# EAGLE design MainBoard (EAGLE 9.5.1)

## Sheet 1 of 2
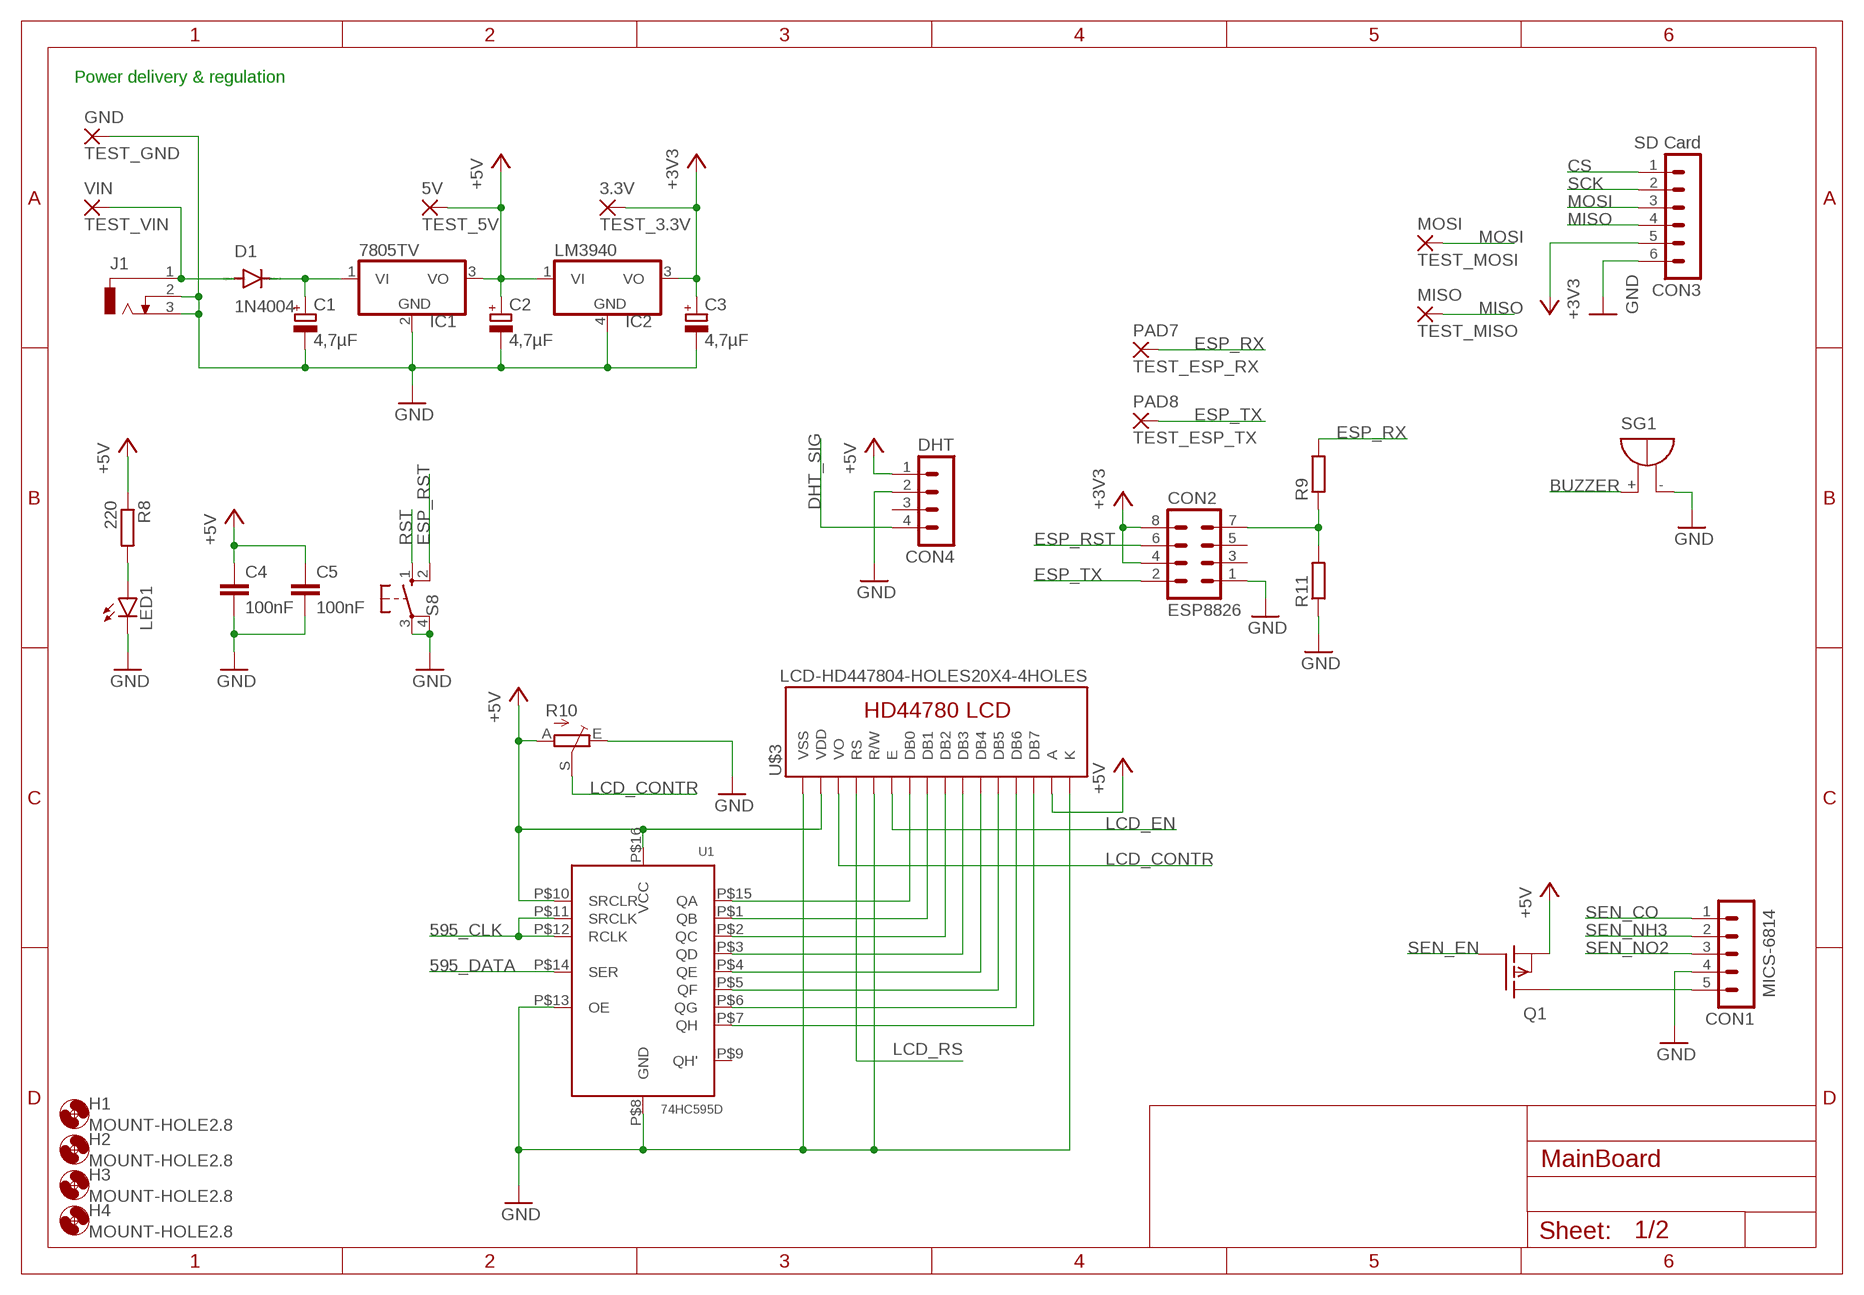
[diagram p0: schematic, sheet 1]

### Parts
3.3V  TEST_3.3V  WIREPAD2,54/0,9  [2,54/0,9]
5V  TEST_5V  WIREPAD2,54/0,9  [2,54/0,9]
C1  4,7µF  CPOL-EUE2,5-6E  [E2,5-6E]
C2  4,7µF  CPOL-EUE2,5-6E  [E2,5-6E]
C3  4,7µF  CPOL-EUE2,5-6E  [E2,5-6E]
C4  100nF  C-EUC0805  [C0805]
C5  100nF  C-EUC0805  [C0805]
CON1  MICS-6814  MA05-1  [MA05-1]
CON2  ESP8826  MA04-2  [MA04-2]
CON3  SD Card  MA06-1  [MA06-1]
CON4  DHT  MA04-1  [MA04-1]
D1  1N4004  BAS15  [DO34-7]
GND  TEST_GND  WIREPAD2,54/0,9  [2,54/0,9]
H1  MOUNT-HOLE2.8  [2,8]
H2  MOUNT-HOLE2.8  [2,8]
H3  MOUNT-HOLE2.8  [2,8]
H4  MOUNT-HOLE2.8  [2,8]
IC1  7805TV  [TO220V]
IC2  LM3940  LM340MP-05  [SOT223]
J1  DCJ0303  [DCJ0303]
LED1  LED3MM  [LED3MM]
MISO  TEST_MISO  WIREPAD2,54/0,9  [2,54/0,9]
MOSI  TEST_MOSI  WIREPAD2,54/0,9  [2,54/0,9]
PAD7  TEST_ESP_RX  WIREPAD2,54/0,9  [2,54/0,9]
PAD8  TEST_ESP_TX  WIREPAD2,54/0,9  [2,54/0,9]
Q1  LP0701N3  [TO-92]
R8  220  R-EU_0204/7  [0204/7]
R9  R-EU_M0805  [M0805]
R10  TRIM_EU-RJ9W  [RJ9W]
R11  R-EU_M0805  [M0805]
S8  10-XX  [B3F-10XX]
SG1  F/TMB  [F/TMB]
U1  74HC595D  74HC595D_SOP16  [SOP-16]
U$3  LCD-HD447804-HOLES20X4-4HOLES  [LCD-20X4-4HOLES]
VIN  TEST_VIN  WIREPAD2,54/0,9  [2,54/0,9]

### Nets
595_CLK: U1.P$11(SRCLK) U1.P$12(RCLK) ; also sheet 2
595_DATA: U1.P$14(SER) ; also sheet 2
+3V3: 3.3V.1(P) C3.+ CON2.4 CON2.8 CON3.5 IC2.3(VO)
+5V: 5V.1(P) C2.+ C4.1 C5.1 CON4.1 IC1.3(VO) IC2.1(VI) Q1.1(S) R8.1 R10.A U1.P$10(SRCLR) U1.P$16(VCC) U$3.P$2(VDD) U$3.P$15(A) ; also sheet 2
BUZZER: SG1.+ ; also sheet 2
CS: CON3.1 ; also sheet 2
DHT_SIG: CON4.4 ; also sheet 2
ESP_RST: CON2.6 S8.2(S1)
ESP_RX: PAD7.1(P) R9.2 ; also sheet 2
ESP_TX: CON2.2 PAD8.1(P) ; also sheet 2
GND: C1.- C2.- C3.- C4.2 C5.2 CON1.4 CON2.1 CON3.6 CON4.2 GND.1(P) IC1.2(GND) IC2.4(GND) J1.2 J1.3 LED1.K(C) R10.E R11.1 S8.3(P) S8.4(P1) SG1.- U1.P$8(GND) U1.P$13(OE) U$3.P$1(VSS) U$3.P$5(R/W) U$3.P$16(K) ; also sheet 2
LCD_CONTR: R10.S U$3.P$3(VO)
LCD_EN: U$3.P$6(E) ; also sheet 2
LCD_RS: U$3.P$4(RS) ; also sheet 2
MISO: CON3.4 MISO.1(P) ; also sheet 2
MOSI: CON3.3 MOSI.1(P) ; also sheet 2
N$1: LED1.A R8.2
N$2: CON2.7 R9.1 R11.2
N$3: U1.P$15(QA) U$3.P$7(DB0)
N$4: U1.P$1(QB) U$3.P$8(DB1)
N$5: U1.P$2(QC) U$3.P$9(DB2)
N$6: U1.P$3(QD) U$3.P$10(DB3)
N$7: U1.P$4(QE) U$3.P$11(DB4)
N$8: U1.P$5(QF) U$3.P$12(DB5)
N$9: U1.P$6(QG) U$3.P$13(DB6)
N$10: U1.P$7(QH) U$3.P$14(DB7)
N$20: D1.A J1.1 VIN.1(P)
N$21: C1.+ D1.C IC1.1(VI)
N$26: CON1.5 Q1.3(D)
RST: S8.1(S) ; also sheet 2
SCK: CON3.2 ; also sheet 2
SEN_CO: CON1.1 ; also sheet 2
SEN_EN: Q1.2(G) ; also sheet 2
SEN_NH3: CON1.2 ; also sheet 2
SEN_NO2: CON1.3 ; also sheet 2
Unconnected: CON2.3 CON2.5 CON4.3 U1.P$9(QH')

### Notes on the sheet
- Power delivery & regulation

## Sheet 2 of 2
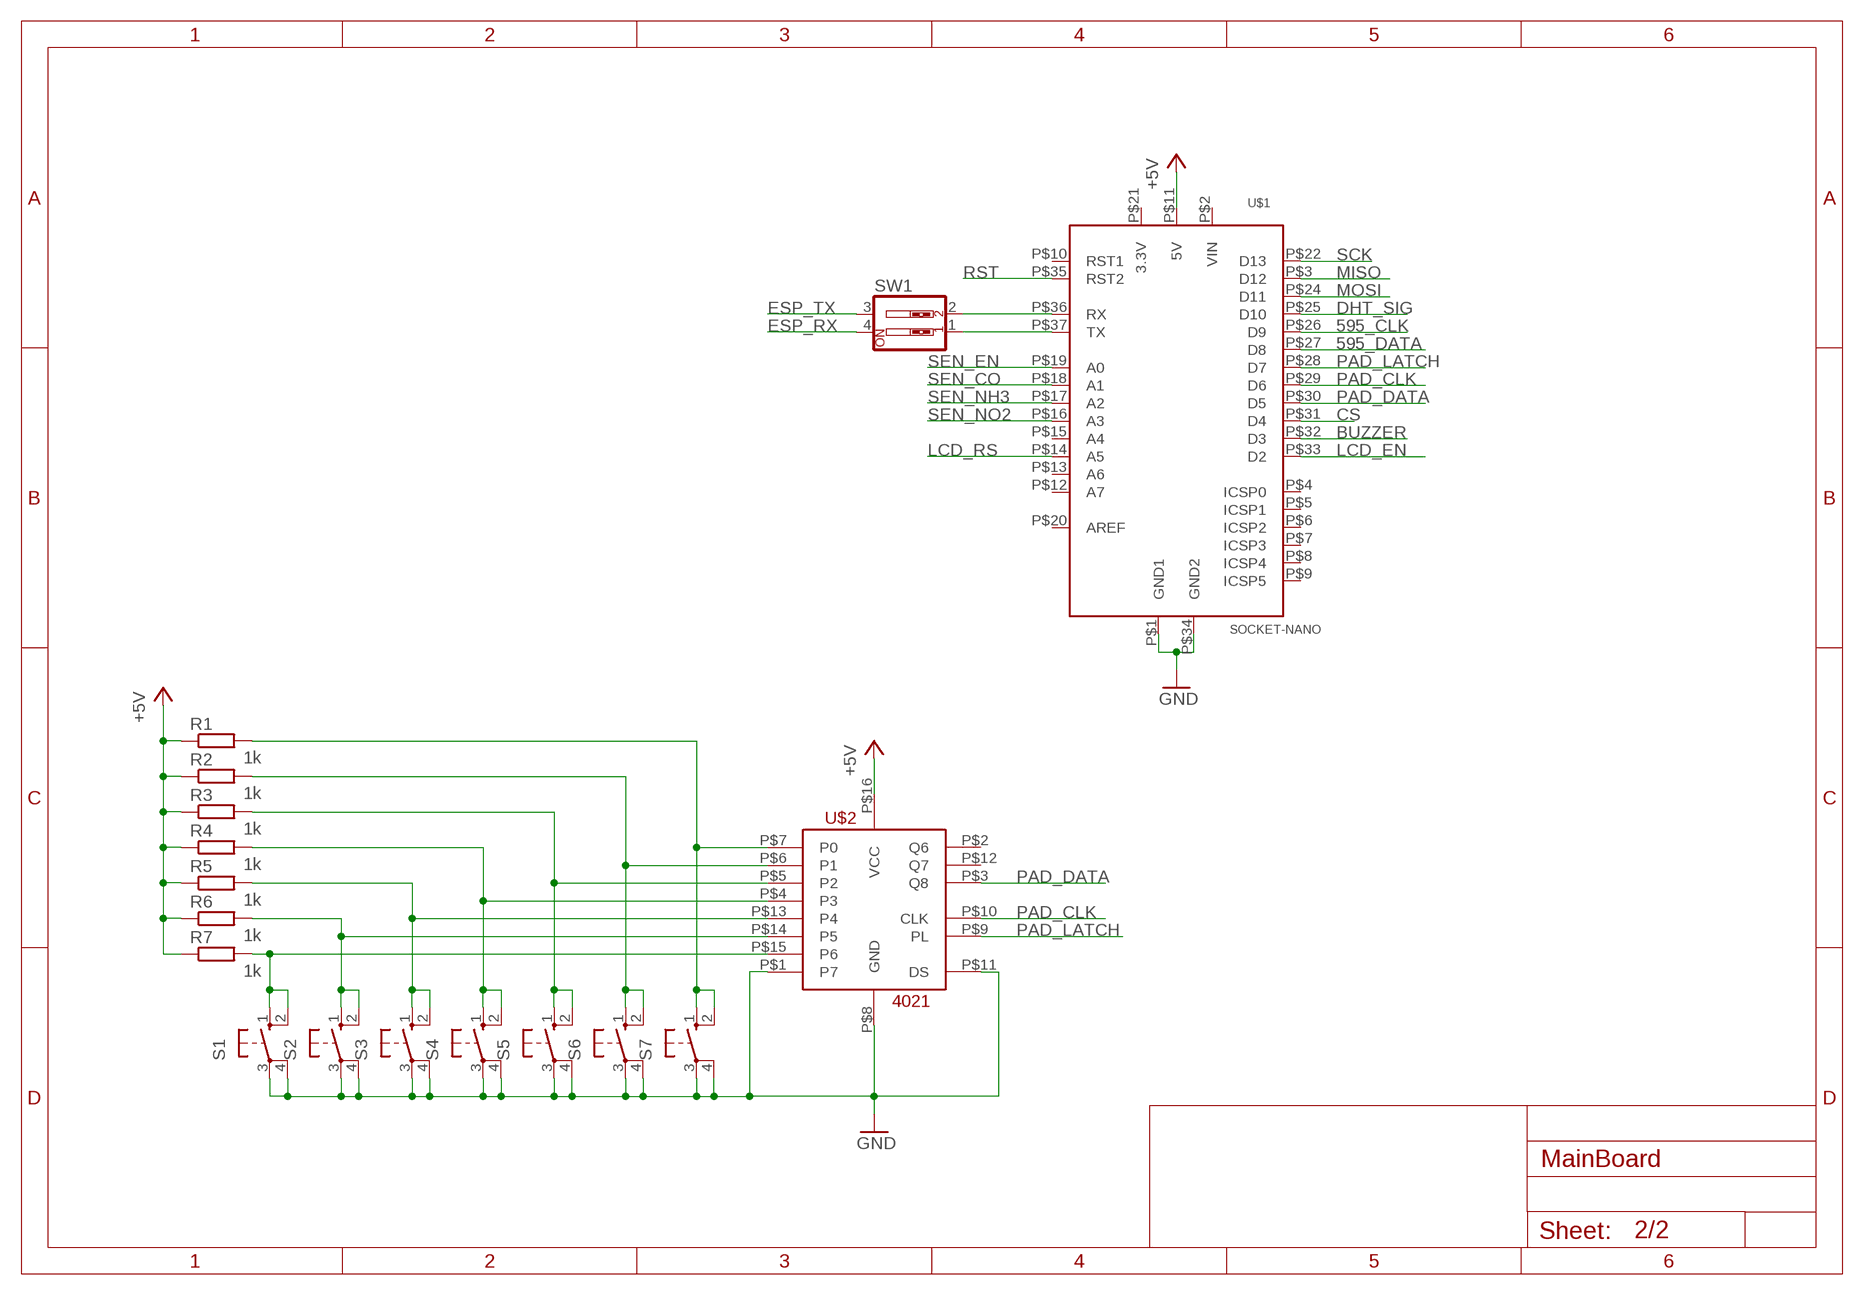
[diagram p1: schematic, sheet 2]

### Parts
R1  1k  R-EU_0204/7  [0204/7]
R2  1k  R-EU_0204/7  [0204/7]
R3  1k  R-EU_0204/7  [0204/7]
R4  1k  R-EU_0204/7  [0204/7]
R5  1k  R-EU_0204/7  [0204/7]
R6  1k  R-EU_0204/7  [0204/7]
R7  1k  R-EU_0204/7  [0204/7]
S1  10-XX  [B3F-10XX]
S2  10-XX  [B3F-10XX]
S3  10-XX  [B3F-10XX]
S4  10-XX  [B3F-10XX]
S5  10-XX  [B3F-10XX]
S6  10-XX  [B3F-10XX]
S7  10-XX  [B3F-10XX]
SW1  SW_DIP-2  [EDG-02]
U$1  SOCKET-NANO  [SOCKET-NANO]
U$2  4021  [DIP]

### Nets
595_CLK: U$1.P$26(D9) ; also sheet 1
595_DATA: U$1.P$27(D8) ; also sheet 1
+5V: R1.1 R2.1 R3.1 R4.1 R5.1 R6.1 R7.1 U$1.P$11(5V) U$2.P$16(VCC) ; also sheet 1
BUZZER: U$1.P$32(D3) ; also sheet 1
CS: U$1.P$31(D4) ; also sheet 1
DHT_SIG: U$1.P$25(D10) ; also sheet 1
ESP_RX: SW1.4 ; also sheet 1
ESP_TX: SW1.3 ; also sheet 1
GND: S1.3(P) S1.4(P1) S2.3(P) S2.4(P1) S3.3(P) S3.4(P1) S4.3(P) S4.4(P1) S5.3(P) S5.4(P1) S6.3(P) S6.4(P1) S7.3(P) S7.4(P1) U$1.P$1(GND1) U$1.P$34(GND2) U$2.P$1(P7) U$2.P$8(GND) U$2.P$11(DS) ; also sheet 1
LCD_EN: U$1.P$33(D2) ; also sheet 1
LCD_RS: U$1.P$14(A5) ; also sheet 1
MISO: U$1.P$3(D12) ; also sheet 1
MOSI: U$1.P$24(D11) ; also sheet 1
N$11: R7.2 S1.1(S) S1.2(S1) U$2.P$15(P6)
N$13: R6.2 S2.1(S) S2.2(S1) U$2.P$14(P5)
N$14: R5.2 S3.1(S) S3.2(S1) U$2.P$13(P4)
N$15: R4.2 S4.1(S) S4.2(S1) U$2.P$4(P3)
N$16: R3.2 S5.1(S) S5.2(S1) U$2.P$5(P2)
N$17: R2.2 S6.1(S) S6.2(S1) U$2.P$6(P1)
N$18: R1.2 S7.1(S) S7.2(S1) U$2.P$7(P0)
N$22: SW1.2 U$1.P$36(RX)
N$23: SW1.1 U$1.P$37(TX)
PAD_CLK: U$1.P$29(D6) U$2.P$10(CLK)
PAD_DATA: U$1.P$30(D5) U$2.P$3(Q8)
PAD_LATCH: U$1.P$28(D7) U$2.P$9(PL)
RST: U$1.P$35(RST2) ; also sheet 1
SCK: U$1.P$22(D13) ; also sheet 1
SEN_CO: U$1.P$18(A1) ; also sheet 1
SEN_EN: U$1.P$19(A0) ; also sheet 1
SEN_NH3: U$1.P$17(A2) ; also sheet 1
SEN_NO2: U$1.P$16(A3) ; also sheet 1
Unconnected: U$1.P$4(ICSP0) U$1.P$5(ICSP1) U$1.P$6(ICSP2) U$1.P$7(ICSP3) U$1.P$8(ICSP4) U$1.P$9(ICSP5) U$1.P$10(RST1) U$1.P$12(A7) U$1.P$13(A6) U$1.P$15(A4) U$1.P$20(AREF) U$2.P$2(Q6) U$2.P$12(Q7)

## Power pins joined to a net without a drawn wire
3.3V: U$1.P$21(3.3V)
VIN: U$1.P$2(VIN)

## Library data of the parts
3.3V 5V GND MISO MOSI PAD7 PAD8 VIN = wirepad:WIREPAD: Wire PAD connect wire on PCB
C1-C3 = rcl:CPOL-EU: POLARIZED CAPACITOR, European symbol; SPICEPREFIX: C
C4 C5 = rcl:C-EU: CAPACITOR, European symbol; SPICEPREFIX: C
CON1 = con-lstb:MA05-1: PIN HEADER; OC_FARNELL: unknown; OC_NEWARK: unknown
CON2 = con-lstb:MA04-2: PIN HEADER; OC_FARNELL: unknown; OC_NEWARK: unknown
CON3 = con-lstb:MA06-1: PIN HEADER; OC_FARNELL: unknown; OC_NEWARK: unknown
CON4 = con-lstb:MA04-1: PIN HEADER; OC_FARNELL: unknown; OC_NEWARK: unknown
D1 = diode:BAS15: DIODE high speed
H1-H4 = holes:MOUNT-HOLE: MOUNTING HOLE with drill center marker
IC1 = linear:78*: Positive VOLTAGE REGULATOR Source: http://cache.national.com/ds/LM/LM78L05.pdf http://www.fairchildsemi.com/ds/LM/LM7805.pdf
IC2 = linear:LM340?-*: Positive VOLTAGE REGULATOR Source: http://cache.national.com/ds/LM/LM340.pdf
J1 = con-jack:DCJ0303: DC POWER JACK Source: DCJ0303.pdf; OC_FARNELL: unknown; OC_NEWARK: unknown
LED1 = led:LED: LED OSRAM: - CHIPLED LG R971, LG N971, LY N971, LG Q971, LY Q971, LO R971, LY R971 LH N974, LH R974 LS Q976, LO Q976, LY Q976 LO Q996 - Hyper CHIPLED LW Q18S LB Q993, LB Q99A, LB R99A - SideLED LS A670, LO A670, LY A670, LG A670, LP A670 LB A673, LV A673, LT A673, LW A673 LH A674 LY A675 LS A676, LA A676, LO A676, LY A676, LW A676 LS A679, LY A679, LG A679 - Hyper Micro SIDELED® LS Y876, LA Y876, LO Y876, LY Y876 LT Y87S - SmartLED LW L88C, LW L88S LB L89C, LB L89S, LG L890 LS L89K, LO L89K, LY L89K LS L896, LA L896, LO L896, LY L896 - TOPLED LS T670, LO T670, LY T670, LG T670, LP T670 LSG T670, LSP T670, LSY T670, LOP T670, LYG T670 LG T671, LOG T671, LSG T671 LB T673, LV T673, LT T673, LW T673 LH T674 LS T676, LA T676, LO T676, LY T676, LB T676, LH T676, LSB T676, LW T676 LB T67C, LV T67C, LT T67C, LS T67K, LO T67K, LY T67K, LW E67C LS E67B, LA E67B, LO E67B, LY E67B, LB E67C, LV E67C, LT E67C LW T67C LS T679, LY T679, LG T679 LS T770, LO T770, LY T770, LG T770, LP T770 LB T773, LV T773, LT T773, LW T773 LH T774 LS E675, LA E675, LY E675, LS T675 LS T776, LA T776, LO T776, LY T776, LB T776 LHGB T686 LT T68C, LB T68C - Hyper Mini TOPLED® LB M676 - Mini TOPLED Santana® LG M470 LS M47K, LO M47K, LY M47K Source: http://www.osram.convergy.de LUXEON: - LUMILED® LXK2-PW12-R00, LXK2-PW12-S00, LXK2-PW14-U00, LXK2-PW14-V00 LXK2-PM12-R00, LXK2-PM12-S00, LXK2-PM14-U00 LXK2-PE12-Q00, LXK2-PE12-R00, LXK2-PE12-S00, LXK2-PE14-T00, LXK2-PE14-U00 LXK2-PB12-K00, LXK2-PB12-L00, LXK2-PB12-M00, LXK2-PB14-N00, LXK2-PB14-P00, LXK2-PB14-Q00 LXK2-PR12-L00, LXK2-PR12-M00, LXK2-PR14-Q00, LXK2-PR14-R00 LXK2-PD12-Q00, LXK2-PD12-R00, LXK2-PD12-S00 LXK2-PH12-R00, LXK2-PH12-S00 LXK2-PL12-P00, LXK2-PL12-Q00, LXK2-PL12-R00 Source: www.luxeon.com KINGBRIGHT: KA-3528ASYC Source: www.kingbright.com
Q1 = transistor-fet:LP0701N3: P-Channel Enhancement MOSFET -16,5V; -1,25A; 1,5Ohm
R1-R9 R11 = rcl:R-EU_: RESISTOR, European symbol; SPICEPREFIX: R
R10 = pot:TRIM_EU-: POTENTIOMETER
S1-S8 = switch-omron:10-XX: OMRON SWITCH; MPN: B3F-1000; OC_FARNELL: 176432; OC_NEWARK: 36M3542
SG1 = buzzer:F/TMB: BUZZER Source: Buerklin; OC_FARNELL: unknown; OC_NEWARK: unknown
SW1 = special:SW_DIP-2: DIP SWITCH
U1 = 74-series-ajouts:74HC595D_SOP16
U$1 = ArduinoSockets:SOCKET-NANO
U$2 = 4021:4021
U$3 = HD44780LCD:LCD-HD44780

## Board
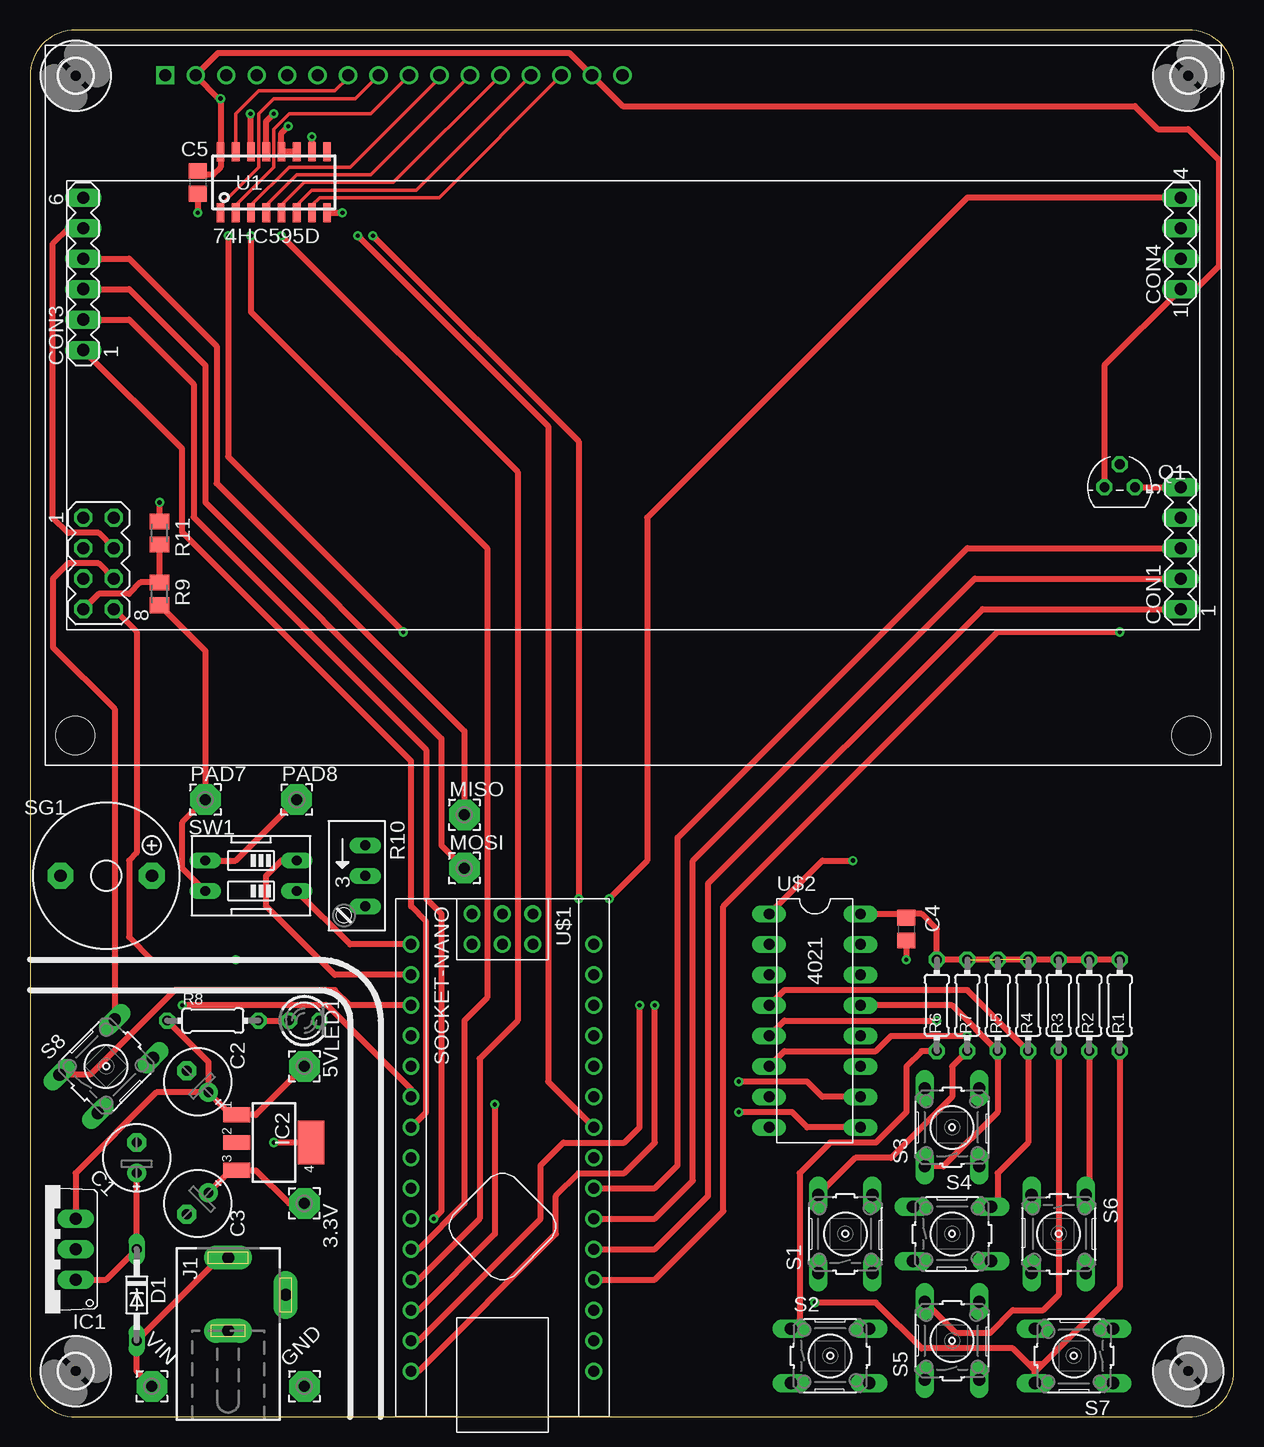
[diagram p2: board, top side]
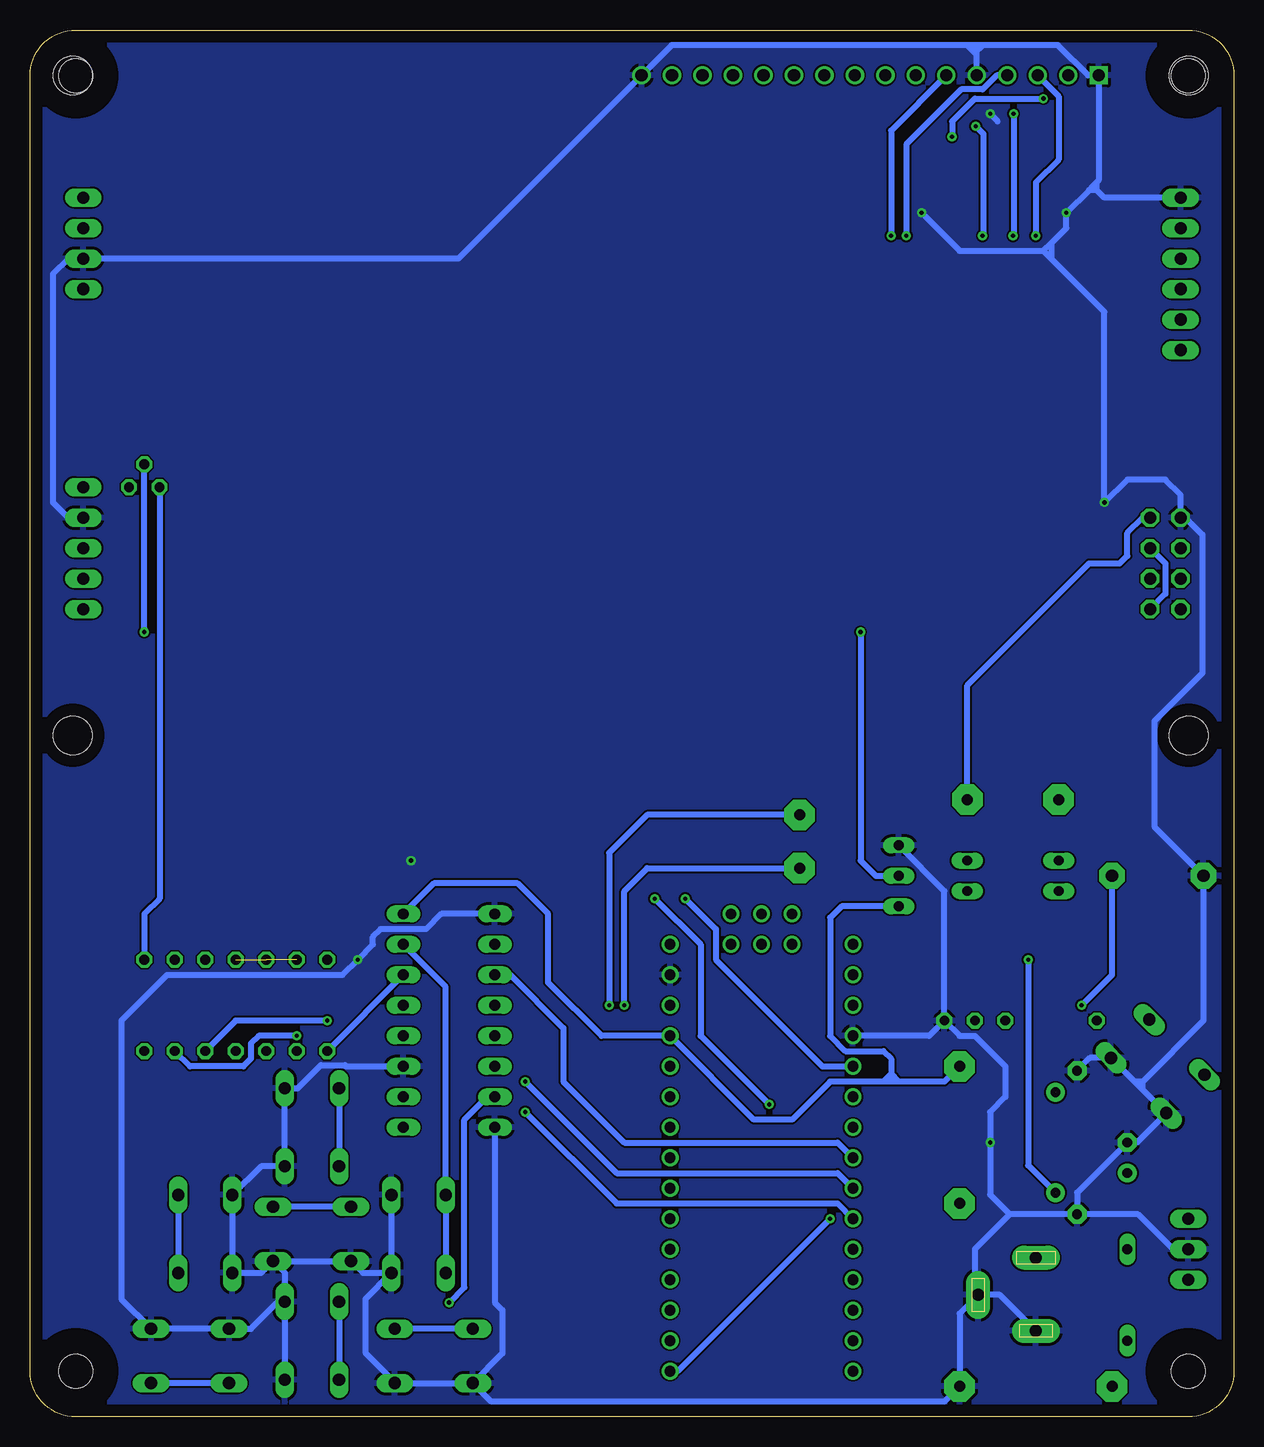
[diagram p3: board, bottom side, seen from below]

Size 100.33 x 115.57 mm. Coordinates in mm from the lower left corner, seen from the top.
Outline: 3.81,0 96.52,0 arc90 100.33,3.81 100.33,111.76 arc90 96.52,115.57 3.81,115.57 arc90 0,111.76 0,3.81 arc90 3.81,0
Copper layers (1*16): Top 0.035mm / dielectric 1.5mm / Bottom 0.035mm
Design rules "default": minimum track width 6mil, minimum drill 0.35mm, track to track 6mil, track to pad 6mil, pad to pad 6mil, via to via 6mil, smd to smd 6mil, copper to edge 40mil, drill to drill 6mil, minimum pad ring 10mil, minimum via ring 8mil, stop-mask expansion 4mil, vias tented up to drill 0mil, thermal gap 10mil

### Footprints (pad centres in the part's own frame; a part is rotated, then mirrored left to right if it is on the bottom)
2,54/0,9 = drill 0.914 pad 2.54 octagon: 1 0,0
E2,5-6E = drill 0.813 pad 1.575: + -1.27,0 | drill 0.813 pad 1.575 octagon: - 1.27,0
C0805 = smd 1.3 x 1.5: 1 -0.95,0; 2 0.95,0
MA05-1 = drill 1.016 long: 1 -5.08,0; 2 -2.54,0; 3 0,0; 4 2.54,0; 5 5.08,0
MA04-2 = drill 1.016 octagon: 1 -3.81,-1.27; 2 -3.81,1.27; 3 -1.27,-1.27; 4 -1.27,1.27; 5 1.27,-1.27; 6 1.27,1.27; 7 3.81,-1.27; 8 3.81,1.27
MA06-1 = drill 1.016 long: 1 -6.35,0; 2 -3.81,0; 3 -1.27,0; 4 1.27,0; 5 3.81,0; 6 6.35,0
MA04-1 = drill 1.016 long: 1 -3.81,0; 2 -1.27,0; 3 1.27,0; 4 3.81,0
DO34-7 = drill 0.813 long: A 3.81,0; C -3.81,0
2,8 = hole 2.8: 0,0
TO220V = drill 1.016 long: 1 -2.54,-2.54; 2 0,-2.54; 3 2.54,-2.54
SOT223 = smd 1.219 x 2.235: 1 -2.311,-3.099; 2 0,-3.099; 3 2.311,-3.099 | smd 3.6 x 2.2: 4 0,3.099
DCJ0303 = drill 1 pad 2 long: 1 0,3.1; 2 4.8,0; 3 0,-3
LED3MM = drill 0.813 octagon: A -1.27,0; K 1.27,0
TO-92 = drill 0.813 octagon: 1 -1.27,0; 2 0,1.905; 3 1.27,0
0204/7 = drill 0.813 octagon: 1 -3.81,0; 2 3.81,0
M0805 = smd 1.3 x 1.6: 1 -0.95,0; 2 0.95,0
RJ9W = drill 0.813 long: A 2.54,0.635; E -2.54,0.635; S 0,0.635
B3F-10XX = drill 1.016 long: 1 -3.251,2.261; 2 3.251,2.261; 3 -3.251,-2.261; 4 3.251,-2.261
F/TMB = drill 1.016 pad 2.159 octagon: + 3.81,0; - -3.81,0
EDG-02 = drill 0.813 long: 1 -1.27,-3.81; 2 1.27,-3.81; 3 1.27,3.81; 4 -1.27,3.81
SOP-16 = smd 0.635 x 1.587: P$1 0,-5.08; P$2 1.27,-5.08; P$3 2.54,-5.08; P$4 3.81,-5.08; P$5 5.08,-5.08; P$6 6.35,-5.08; P$7 7.62,-5.08; P$8 8.89,-5.08; P$9 8.89,0; P$10 7.62,0; P$11 6.35,0; P$12 5.08,0; P$13 3.81,0; P$14 2.54,0; P$15 1.27,0; P$16 0,0
SOCKET-NANO = drill 0.9: P$1 7.62,34.29; P$2 7.62,36.83; P$3 -7.62,1.27; P$4 2.54,36.83; P$5 2.54,39.37; P$6 0,36.83; P$7 0,39.37; P$8 -2.54,36.83; P$9 -2.54,39.37; P$10 7.62,31.75; P$11 7.62,29.21; P$12 7.62,26.67; P$13 7.62,24.13; P$14 7.62,21.59; P$15 7.62,19.05; P$16 7.62,16.51; P$17 7.62,13.97; P$18 7.62,11.43; P$19 7.62,8.89; P$20 7.62,6.35; P$21 7.62,3.81; P$22 7.62,1.27; P$24 -7.62,3.81; P$25 -7.62,6.35; P$26 -7.62,8.89; P$27 -7.62,11.43; P$28 -7.62,13.97; P$29 -7.62,16.51; P$30 -7.62,19.05; P$31 -7.62,21.59; P$32 -7.62,24.13; P$33 -7.62,26.67; P$34 -7.62,29.21; P$35 -7.62,31.75; P$36 -7.62,34.29; P$37 -7.62,36.83
DIP = drill 0.9 long: P$1 -12.7,-2.54; P$2 -10.16,-2.54; P$3 -7.62,-2.54; P$4 -5.08,-2.54; P$5 -2.54,-2.54; P$6 0,-2.54; P$7 2.54,-2.54; P$8 5.08,-2.54; P$9 5.08,5.08; P$10 2.54,5.08; P$11 0,5.08; P$12 -2.54,5.08; P$13 -5.08,5.08; P$14 -7.62,5.08; P$15 -10.16,5.08; P$16 -12.7,5.08
LCD-20X4-4HOLES = drill 1.016 square: P$1 10,57.5 | drill 1.016: P$2 12.54,57.5; P$3 15.08,57.5; P$4 17.62,57.5; P$5 20.16,57.5; P$6 22.7,57.5; P$7 25.24,57.5; P$8 27.78,57.5; P$9 30.32,57.5; P$10 32.86,57.5; P$11 35.4,57.5; P$12 37.94,57.5; P$13 40.48,57.5; P$14 43.02,57.5; P$15 45.56,57.5; P$16 48.1,57.5 | hole 3.2: 2.5,2.5; 2.5,57.5; 95.5,57.5; 95.5,2.5

### Placement (x,y rotation side)
3.3V  22.86,17.78 270 top
5V  22.86,29.21 270 top
C1  8.89,21.59 90 top
C2  13.97,27.94 135 top
C3  13.97,17.78 225 top
C4  73.03,40.64 270 top
C5  13.97,102.87 270 top
CON1  95.89,72.39 90 top
CON2  5.71,71.12 270 top
CON3  4.45,95.25 90 top
CON4  95.89,97.79 90 top
D1  8.89,10.16 270 top
GND  22.86,2.54 0 top
H1  3.81,3.81 0 top
H2  96.52,3.81 0 top
H3  96.52,111.76 0 top
H4  3.81,111.76 0 top
IC1  1.27,13.97 90 top
IC2  20.32,22.86 270 top
J1  16.51,10.16 0 top
LED1  22.86,33.02 0 top
MISO  36.2,50.16 0 top
MOSI  36.2,45.72 0 top
PAD7  14.61,51.44 0 top
PAD8  22.23,51.44 0 top
Q1  90.81,77.47 0 top
R1  90.81,34.29 270 top
R2  88.27,34.29 270 top
R3  85.72,34.29 270 top
R4  83.19,34.29 270 top
R5  80.64,34.29 270 top
R6  75.56,34.29 270 top
R7  78.11,34.29 270 top
R8  15.24,33.02 0 top
R9  10.79,68.58 270 top
R10  27.3,45.09 270 top
R11  10.79,73.66 270 top
S1  67.94,15.24 90 top
S2  66.67,5.08 0 top
S3  76.83,24.13 90 top
S4  76.83,15.24 0 top
S5  76.83,6.35 90 top
S6  85.72,15.24 270 top
S7  87,5.08 180 top
S8  6.35,29.21 45 top
SG1  6.35,45.09 0 top
SW1  18.41,45.09 90 top
U1  15.88,105.41 0 top
U$1  39.37,2.54 0 top
U$2  64.14,29.21 270 top
U$3  1.27,54.29 0 top
VIN  10.16,2.54 0 top

### Tracks (layer width: path | path; a pad name or v marks a point on that pad's centre or on a via)
595_CLK  (via drill 0.35)
  Top 0.508: v21.52,107.55 20.95,106.98 U1.P$12 U1.P$11 | v20.95,98.42 40.64,78.74 40.64,33.02 37.47,29.84 37.47,16.51 32.38,11.43 U$1.P$26
  Bottom 0.508: v21.52,107.55 20.88,106.91 20.88,98.5 v20.95,98.42
595_DATA  (via drill 0.35)
  Top 0.508: U1.P$14 18.41,108.54 v18.37,108.58 | v18.41,98.42 18.41,92.08 38.1,72.39 38.1,34.92 36.2,33.02 36.2,17.78 32.38,13.97 U$1.P$27
  Bottom 0.508: v18.37,108.58 18.37,98.47 v18.41,98.42
+3V3  (via drill 0.35)  (1 unrouted)
  Top 0.508: C3.+ 16.74,20.55 IC2.3 18.82,20.55 21.59,17.78 3.3V.1 | CON2.8 8.89,65.41 8.89,46.99 8.26,46.35 8.26,40.01 10.16,38.1 v17.14,38.1 | CON2.4 5.71,73.66 3.17,73.66 1.91,74.93 1.91,97.79 3.17,99.06 CON3.5
  Bottom 0.508: CON2.4 5.71,71.12 5.71,68.58 CON2.8 | v17.14,38.1 17.14,20.95 C3.+
+5V  (via drill 0.35)  (3 unrouted)
  Top 0.508: C2.+ 16.74,25.17 IC2.1 18.82,25.17 5V.1 | C2.+ 10.53,27.04 3.81,20.32 IC1.3 | R8.1 14.87,29.58 C2.+ | U$2.P$16 72.7,41.91 C4.1 73.34,41.91 74.3,41.91 75.56,40.64 R6.1 R2.1 | R1.1 R2.1 | R2.1 R3.1 R4.1 | C5.1 14.29,103.5 15.24,103.5 15.88,104.14 U1.P$16 v15.88,109.86 15.75,109.86 U$3.P$2 15.68,113.67 44.96,113.67 U$3.P$15 49.4,109.22 92.08,109.22 93.98,107.31 96.52,107.31 99.06,104.78 99.06,95.89 97.16,93.98 CON4.1 89.53,87.63 Q1.1 | v23.5,106.68 U1.P$10
  Bottom 0.508: v15.88,109.86 21.59,109.86 23.5,107.95 v23.5,106.68 | Q1.1 89.53,43.18 90.81,41.91 R1.1 | 5V.1 24.13,27.94 27.94,27.94 | 27.94,27.94 28.57,27.94 | 28.57,27.94 29.21,27.94 | 29.21,27.94 33.66,27.94 36.83,24.77 40.01,24.77 U$1.P$11 52.7,31.75 57.15,36.2 57.15,41.91 59.69,44.45 66.67,44.45 U$2.P$16 | R10.A 32.7,42.55 33.66,41.59 33.66,31.75 32.38,30.48 29.21,30.48 28.57,29.84 28.57,28.57 | 28.57,28.57 28.57,27.94 | 27.94,27.94 28.57,28.57 | 29.21,27.94 28.57,28.57
BUZZER  (via drill 0.35)
  Top 0.508: U$1.P$32 31.75,27.3 24.77,34.29 v12.7,34.29
  Bottom 0.508: v12.7,34.29 10.16,36.83 SG1.+
CS
  Top 0.508: CON3.1 12.65,80.7 12.65,73.75 31.75,54.65 31.75,42.55 33.02,41.27 33.02,25.4 U$1.P$31
DHT_SIG  (via drill 0.35)
  Top 0.508: CON4.4 78.11,101.6 51.44,74.93 51.44,46.35 v48.26,43.18 | v38.73,26.04 38.73,15.24 32.38,8.89 U$1.P$25
  Bottom 0.508: v48.26,43.18 44.45,39.37 44.45,31.75 v38.73,26.04
ESP_RST
  Top 0.508: CON2.6 5.71,71.12 3.17,71.12 1.91,69.85 1.91,64.14 7.05,58.99 S8.2
ESP_RX
  Top 0.508: SW1.4 12.7,45.72 12.7,49.53 PAD7.1 14.61,63.82 R9.2
ESP_TX
  Top 0.508: SW1.3 17.14,46.35 PAD8.1
  Bottom 0.508: PAD8.1 22.23,60.96 12.06,71.12 9.53,71.12 8.89,71.75 8.89,73.66 7.62,74.93 CON2.2
GND  (via drill 0.35)
  Top 0.508: IC2.4 v20.32,22.86 | C4.2 v73.03,38.1 | C5.2 v13.97,100.33 | U1.P$8 v26.04,100.33 | U1.P$13 19.68,107.95 v20.32,108.58 | R11.1 v10.79,76.2 | U$2.P$1 66.04,46.35 v68.58,46.35
  Bottom 0.508: J1.3 19.51,10.16 J1.2 | J1.2 22.86,8.61 GND.1 24.13,1.27 61.87,1.27 S2.3 | C3.- 18.68,16.88 | 18.68,16.88 21.59,13.97 21.59,10.44 J1.2 | 18.68,16.88 20.32,18.52 v20.32,22.86 20.32,25.4 19.05,26.67 19.05,29.21 21.59,31.75 22.86,31.75 LED1.K | S8.4 7.95,27.61 | 7.95,27.61 S8.3 8.1,22.86 C1.- 13.07,18.68 C3.- | IC1.2 5.08,13.97 7.99,16.88 C3.- | S8.4 12,29.91 C2.- | S1.3 72.59,11.99 S4.3 S4.4 | S1.4 S1.3 | S2.4 69.85,2.82 | 69.85,2.82 S2.3 | S5.3 S5.4 79.1,10.16 | S6.4 83.19,11.99 | 83.19,11.99 81.08,11.99 S4.4 | S4.4 79.1,11.99 79.1,10.16 | 79.1,10.16 81.92,7.34 S7.4 S7.3 92.71,9.8 92.71,33.02 88.9,36.83 74.3,36.83 v73.03,38.1 71.75,39.37 71.75,40.01 71.12,40.64 67.31,40.64 66.04,41.91 U$2.P$1 | 83.19,11.99 83.46,12.27 S6.3 81.08,20.88 S3.3 S3.4 | 79.38,27.66 S3.4 | S3.4 78.03,27.38 76.1,29.31 74.09,29.31 73.99,29.21 U$2.P$11 | S1.3 72.39,9.8 72.39,5.36 69.85,2.82 | 11.43,102.87 11.27,103.03 U$3.P$1 12.16,111.79 14.66,114.3 20.95,114.3 | 11.43,102.87 11.75,102.55 | 11.75,102.55 12.06,102.23 | 12.06,102.23 v13.97,100.33 13.97,99.06 15.24,97.79 | v20.32,108.58 19.68,107.95 | 15.88,97.16 22.86,97.16 v26.04,100.33 | 15.88,97.16 15.24,97.79 | 20.95,114.3 21.59,114.3 | 21.59,114.3 22.23,114.3 | 22.23,114.3 46.86,114.3 U$3.P$16 64.64,96.52 CON4.2 97.16,96.52 98.42,95.25 98.42,76.2 97.16,74.93 CON1.4 | 10.16,30 S8.4 | CON3.6 10.79,101.6 11.43,102.23 | 11.43,102.23 11.75,102.55 | 11.43,102.23 12.06,102.23 | 11.43,102.23 11.43,102.87 | 15.24,96.52 10.79,92.08 v10.79,76.2 8.89,78.11 5.71,78.11 4.45,76.83 CON2.1 4.06,74.93 2.64,73.51 2.64,61.98 6.64,57.98 6.64,49.19 SG1.- 2.54,33.02 7.62,27.94 | 15.24,96.52 15.88,97.16
  Bottom 0.508: 15.24,97.79 15.24,96.52 | U$3.P$5 21.43,114.14 21.59,114.3 | 20.95,114.3 21.59,113.67 22.23,114.3 | LED1.K 25.4,31.75 U$1.P$34 | LED1.K 24.13,43.81 R10.E | U$2.P$8 61.59,9.53 60.96,8.89 60.96,5.28 S2.3 | 7.62,27.94 7.95,27.61 | 7.62,27.3 7.62,27.94 | 7.62,27.94 8.26,27.94
  pour Bottom: 0,107.95 7.62,115.57 92.71,115.57 100.33,107.95 100.33,7.62 92.71,0 90.17,0 7.62,0 0,7.62
LCD_CONTR  (via drill 0.35)
  Top 0.508: v31.11,65.41 16.51,80.01 v16.51,98.42
  Bottom 0.508: U$3.P$3 14.61,110.05 14.61,104.78 16.51,102.87 v16.51,98.42 | v31.11,65.41 31.11,46.35 29.84,45.09 R10.S
LCD_EN  (via drill 0.35)
  Top 0.508: v28.57,98.42 45.72,81.28 v45.72,43.18
  Bottom 0.508: U$3.P$6 28.57,107.19 v28.57,98.42 | v45.72,43.18 43.18,40.64 43.18,38.1 34.29,29.21 U$1.P$33
LCD_RS  (via drill 0.35)
  Top 0.508: v27.3,98.42 43.18,82.55 43.18,27.94 U$1.P$14
  Bottom 0.508: U$3.P$4 19.78,111.79 20.95,110.62 22.73,110.62 27.3,106.05 v27.3,98.42
MISO  (via drill 0.35)
  Top 0.508: CON3.4 8.26,96.52 15.56,89.22 15.56,77.79 36.2,57.15 MISO.1 | U$1.P$3 32.38,3.81 43.81,15.24 43.81,18.41 45.72,20.32 49.53,20.32 52.07,22.86 v52.07,34.29
  Bottom 0.508: MISO.1 48.9,50.16 52.07,46.99 v52.07,34.29
MOSI  (via drill 0.35)
  Top 0.508: MOSI.1 34.29,47.62 34.29,56.52 14.61,76.2 14.61,87.63 8.26,93.98 CON3.3 | U$1.P$24 32.38,6.35 42.55,16.51 42.55,20.95 44.45,22.86 49.53,22.86 50.8,24.13 v50.8,34.29
  Bottom 0.508: v50.8,34.29 50.8,43.81 48.9,45.72 MOSI.1
N$1
  Top 0.508: R8.2 LED1.A
N$2
  Top 0.508: R11.2 R9.1 9.21,69.53 8.26,68.58 5.71,68.58 CON2.7
N$3
  Top 0.305: U1.P$15 17.14,108.58 19.05,110.49 25.4,110.49 26.51,111.6 U$3.P$7
N$4
  Top 0.305: U1.P$1 15.88,100.97 19.05,104.14 19.05,108.58 20.32,109.86 27.11,109.86 U$3.P$8
N$5
  Top 0.305: U1.P$2 17.14,100.97 20.32,104.14 20.32,107.31 21.59,108.58 28.38,108.58 U$3.P$9
N$6
  Top 0.305: U1.P$3 18.41,100.97 21.59,104.14 26.67,104.14 34.13,111.6 U$3.P$10
N$7
  Top 0.305: U1.P$4 19.68,100.97 22.23,103.5 28.38,103.5 U$3.P$11
N$8
  Top 0.305: U1.P$5 20.95,100.97 22.86,102.87 30.29,102.87 U$3.P$12
N$9
  Top 0.305: U1.P$6 22.23,100.97 23.5,102.23 32.19,102.23 U$3.P$13
N$10
  Top 0.305: U1.P$7 23.5,100.97 24.13,101.6 34.1,101.6 U$3.P$14
N$11
  Top 0.508: R7.2 76.83,29.21 76.83,26.67 71.75,21.59 68.78,21.59 S1.2
  Bottom 0.508: S1.1 S1.2 65.68,35.84 U$2.P$15
N$13
  Top 0.508: R6.2 74.3,30.48 73.03,29.21 73.03,25.4 70.48,22.86 66.67,22.86 64.14,20.32 64.14,8.05 S2.1
  Bottom 0.508: S2.1 S2.2 | R6.2 U$2.P$14
N$14
  Top 0.508: S3.1 76.12,20.88 80.64,25.4 R5.2 76.83,34.29 U$2.P$13
  Bottom 0.508: S3.2 S3.1
N$15
  Top 0.508: S4.2 80.64,18.06 80.64,20.32 83.19,22.86 R4.2 78.11,35.56 62.87,35.56 U$2.P$4
  Bottom 0.508: S4.1 S4.2
N$16  (via drill 0.35)
  Top 0.508: R3.2 85.72,10.16 84.45,8.89 81.92,8.89 80.01,6.99 77.19,6.99 S5.2 | U$2.P$5 62.87,33.02 v75.56,33.02
  Bottom 0.508: S5.2 S5.1 | v75.56,33.02 83.19,33.02 R3.2
N$17  (via drill 0.35)
  Top 0.508: R2.2 88.27,18.77 S6.1 | U$2.P$6 62.87,30.48 70.48,30.48 71.75,31.75 v78.11,31.75
  Bottom 0.508: S6.1 S6.2 | R2.2 87,29.21 82.55,29.21 81.92,29.84 81.92,31.11 81.28,31.75 v78.11,31.75
N$18  (via drill 0.35)
  Top 0.508: R1.2 90.81,10.79 84.45,4.45 | 84.45,4.45 83.74,3.73 S7.2 83.74,3.89 83.19,4.45 | 83.19,4.45 81.92,5.71 74.3,5.71 70.48,9.53 v65.41,9.53 | 83.19,4.45 84.45,4.45
  Bottom 0.508: S7.2 S7.1 | v65.41,9.53 64.14,10.79 64.14,24.77 62.23,26.67 U$2.P$7
N$20
  Top 0.508: VIN.1 8.89,3.81 D1.A 15.8,13.26 J1.1
N$21
  Top 0.508: IC1.1 6.35,11.43 D1.C C1.+
N$22
  Top 0.508: U$1.P$36 25.4,36.83 19.68,42.55 19.68,45.09 20.95,46.35 SW1.2
N$23
  Top 0.508: U$1.P$37 26.67,39.37 SW1.1
N$26
  Top 0.508: Q1.3 CON1.5
PAD_CLK  (via drill 0.35)
  Top 0.508: U$2.P$10 66.04,26.67 64.77,27.94 v59.05,27.94
  Bottom 0.508: v59.05,27.94 51.44,20.32 33.02,20.32 U$1.P$29
PAD_DATA
  Bottom 0.508: U$2.P$3 60.33,36.83 55.88,32.38 55.88,27.94 50.8,22.86 33.02,22.86 U$1.P$30
PAD_LATCH  (via drill 0.35)
  Top 0.508: v59.05,25.4 63.5,25.4 64.77,24.13 U$2.P$9
  Bottom 0.508: v59.05,25.4 51.44,17.78 33.02,17.78 U$1.P$28
RST
  Top 0.508: U$1.P$35 26.67,34.29 25.4,35.56 12.06,35.56 5.01,28.51 S8.1
SCK  (via drill 0.35)
  Top 0.508: CON3.2 8.26,91.44 13.63,86.07 13.63,74.97 33.02,55.58 33.02,43.18 34.29,41.91 34.29,17.14 v33.66,16.51
  Bottom 0.508: v33.66,16.51 46.35,3.81 U$1.P$22
SEN_CO
  Top 0.508: U$1.P$18 52.07,13.97 56.52,18.41 56.52,44.45 79.38,67.31 CON1.1
SEN_EN  (via drill 0.35)
  Top 0.508: U$1.P$19 52.07,11.43 57.78,17.14 57.78,42.55 80.64,65.41 v90.81,65.41
  Bottom 0.508: v90.81,65.41 Q1.2
SEN_NH3
  Top 0.508: U$1.P$17 52.07,16.51 55.24,19.68 55.24,46.35 78.74,69.85 CON1.2
SEN_NO2
  Top 0.508: U$1.P$16 52.07,19.05 53.98,20.95 53.98,48.26 78.11,72.39 CON1.3